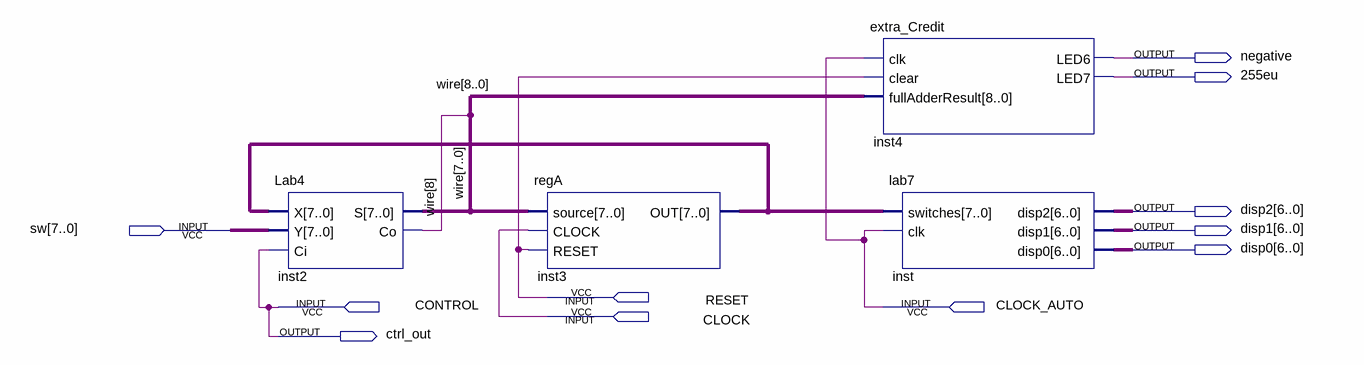
[diagram p0: schematic sheet]
// Quartus schematic lab8.bdf as structural Verilog: 4 symbols, 11 pins
module lab8 (
  input  [7:0] sw,
  input  RESET,
  input  CONTROL,
  input  CLOCK_AUTO,
  input  CLOCK,
  output negative,
  output \255eu ,
  output [6:0] disp2,
  output [6:0] disp1,
  output [6:0] disp0,
  output ctrl_out
);

  wire [7:0] inst3_out;
  wire [8:0] \wire ;

  Lab4 inst2 (.X(inst3_out), .Y(sw), .Ci(CONTROL), .S(\wire [7:0]), .Co(\wire [8]));
  regA inst3 (.source(\wire [7:0]), .CLOCK(CLOCK), .RESET(RESET), .OUT(inst3_out));
  extra_Credit inst4 (.clk(CLOCK_AUTO), .clear(RESET), .fullAdderResult(\wire ), .LED6(negative), .LED7(\255eu ));
  lab7 inst (.switches(inst3_out), .clk(CLOCK_AUTO), .disp2(disp2), .disp1(disp1), .disp0(disp0));

  assign ctrl_out = CONTROL;
endmodule
